# Altium project 105358-3BA002-01_EFM1-hybrid.PrjPCB (part 1 of 2)
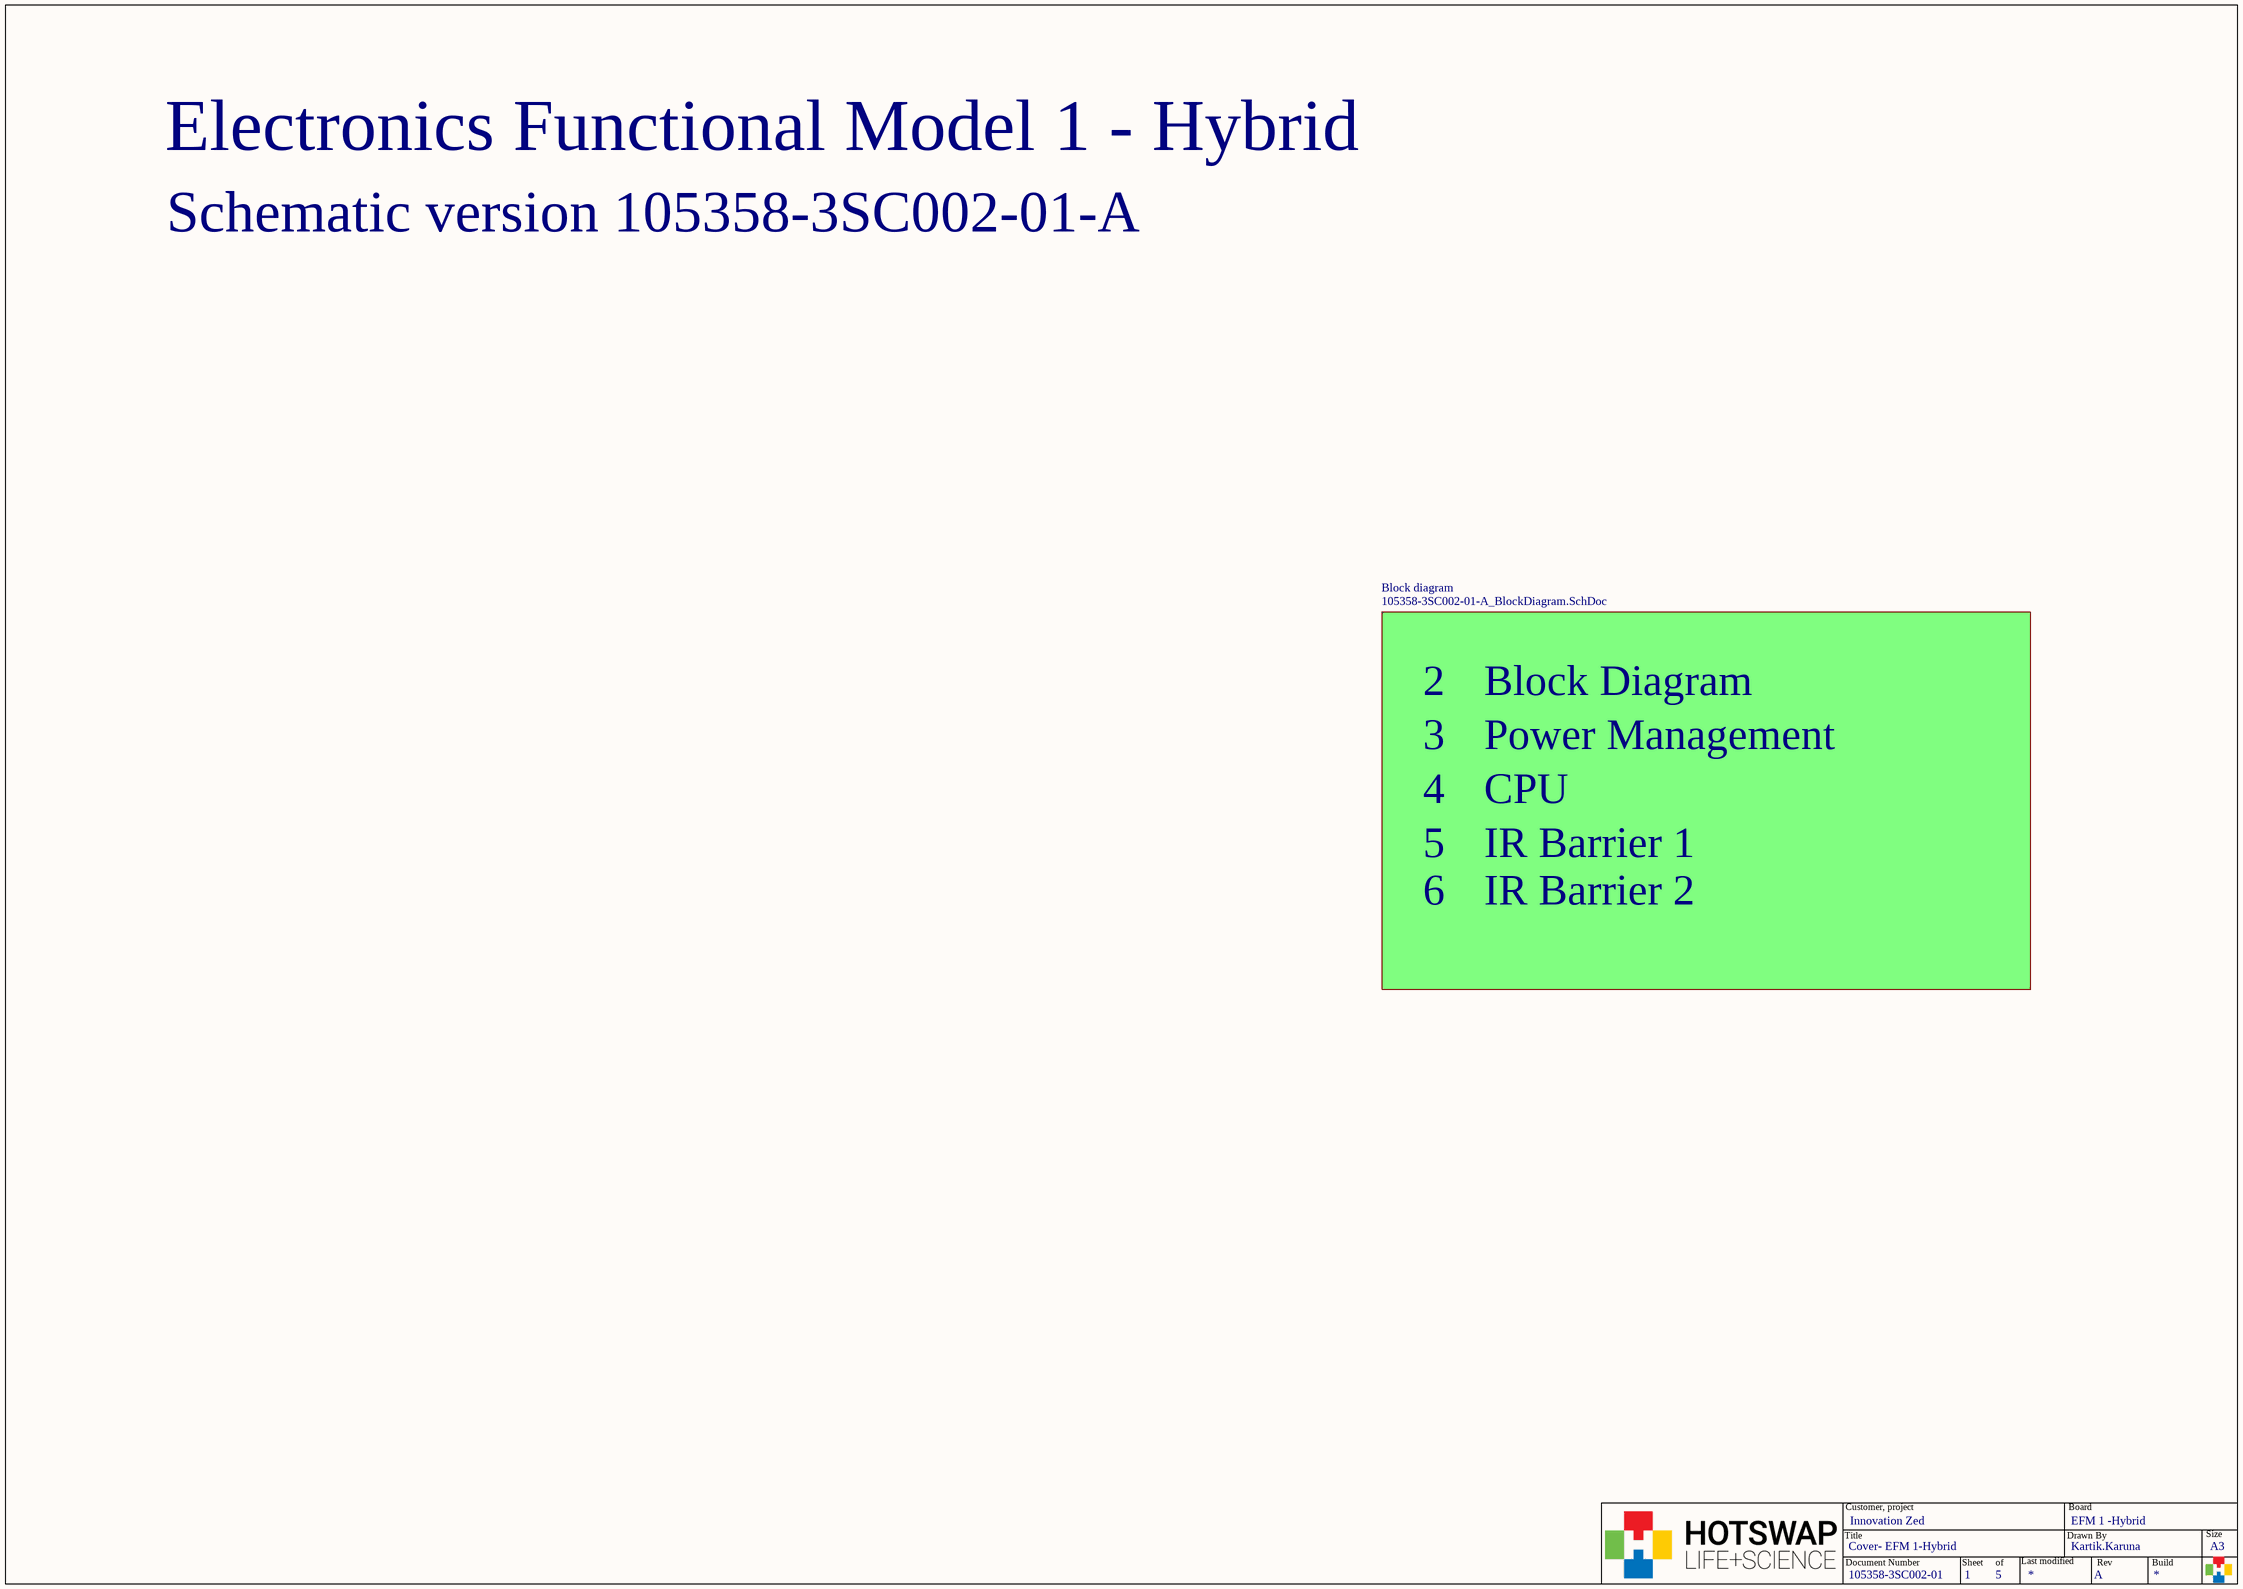
[diagram p0: 105358-3SC002-01-A_Cover.SchDoc]
PrjVersionControl_RevNumber: ' A '; Project_Board: EFM 1 -Hybrid; Project_Customer: Innovation Zed; Project_Document_Number: 105243-3BA001-01-B; Project_Drawn_By: Kartik.Karuna; Project_Revision: A; Project_Total_Sheets: X
6 sheets, 350 parts. Net scope: hierarchical (ports join the sheet entries above them; power ports are global).
Board file: 105358-3LA002-01_EFM1-Hybrid.PcbDoc
Sheets:
  105358-3SC002-01-A_Cover.SchDoc
    Block diagram = 105358-3SC002-01-A_BlockDiagram.SchDoc
      Power Management = 105358-3SC002-01-A_PWR_MGMT.SchDoc
      CPU Board = 105358-3SC002-01-A_CPU.SchDoc
      IO Board = 105358-3SC002-01-A_IR.SchDoc
      IO Board-Extra = 105358-3SC002-01-A_IR_extra.SchDoc

## Sheet 105358-3SC002-01-A_Cover.SchDoc: Cover- EFM 1-Hybrid
size 420 x 297 mm; DrawnBy: KaKa; Organization: Hotswap Norden AB; Address1: Knarrarnäsgatan 7; Address2: SE-164 40 Kista; Address3: Sweden; DocumentNumber: 105358-3SC002-01; SheetNumber: 1; SheetTotal: 5; PageSetup: Record=PageOptions|CenterHorizontal=True|CenterVertical=True|PrintScale=0.98|XCorrection=1.00|YCorrection=1.00|PrintKind=0|BorderSize=5000000|LeftOffset=0|BottomOffset=0|Orientation=2|PaperLength=1000|PaperWidth=1000|Scale=100|PaperSource=7|PrintQuality=-3|MediaType=1|DitherType=10|PrintScaleMode=1|PaperKind=A3|PaperIndex=8

### Sub-sheets
Block diagram = 105358-3SC002-01-A_BlockDiagram.SchDoc: no entries

### Notes on the sheet
- Electronics Functional Model 1 - Hybrid
- Schematic version 105358-3SC002-01-A
- 2
- Block Diagram
- 3
- Power Management
- 4
- 5
- IR Barrier 1
- CPU
- 6
- IR Barrier 2
- Title
- Customer, project
- Drawn By
- Board
- Size
- Document Number
- Sheet
- of
- Last modified
- Rev
- Build
- A3

## Sheet 105358-3SC002-01-A_BlockDiagram.SchDoc: Block Diagram
size 420 x 297 mm; DrawnBy: JeSa , KaKa; Organization: Hotswap Norden AB; Address1: Knarrarnäsgatan 7; Address2: SE-164 40 Kista; Address3: Sweden; DocumentNumber: 105358-3SC001-01; SheetNumber: 2; SheetTotal: 5; PageSetup: Record=PageOptions|CenterHorizontal=True|CenterVertical=True|PrintScale=0.96|XCorrection=1.00|YCorrection=1.00|PrintKind=0|BorderSize=5000000|LeftOffset=0|BottomOffset=0|Orientation=2|PaperLength=1000|PaperWidth=1000|Scale=100|PaperSource=7|PrintQuality=-4|MediaType=1|DitherType=10|PaperKind=A3|PrintScaleMode=1
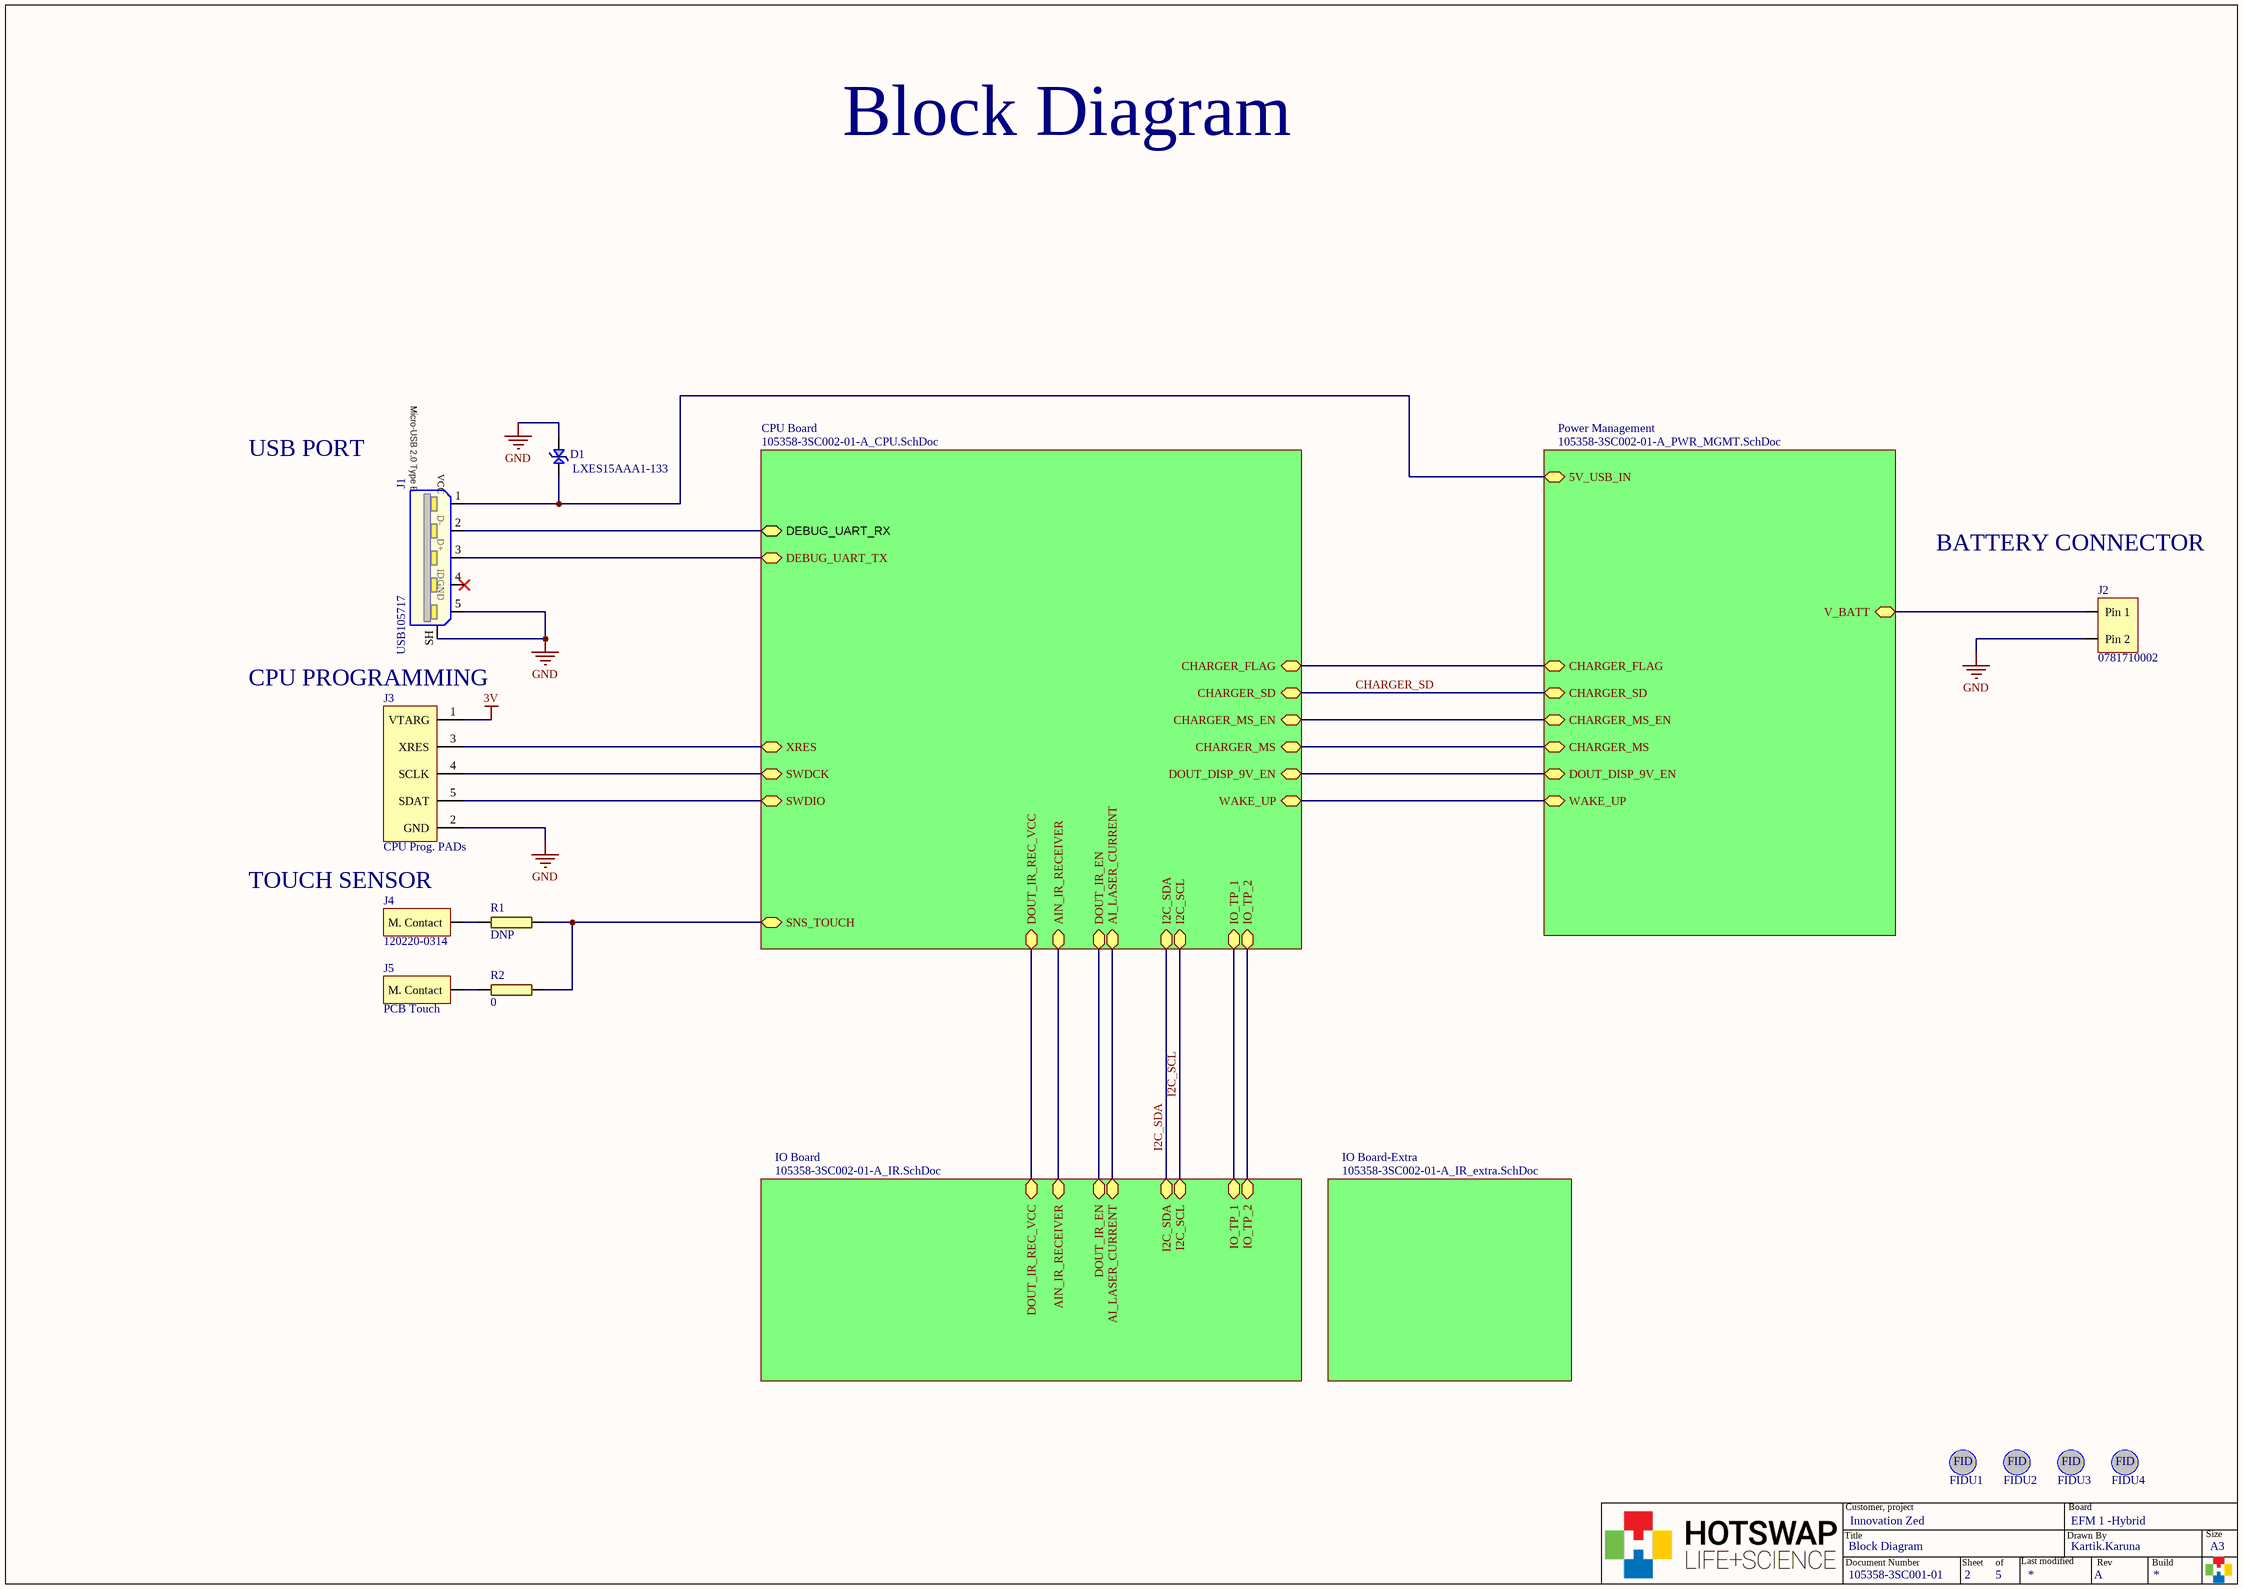
[diagram p1: 105358-3SC002-01-A_BlockDiagram.SchDoc]

### Parts
D1  LXES15AAA1-133  [0402C-GENERIC]
FIDU1  FIDU-miniROUND  [FIDU-MINI-ROUND]  (value not drawn)  (no BOM)
FIDU2  FIDU-miniROUND  [FIDU-MINI-ROUND]  (value not drawn)  (no BOM)
FIDU3  FIDU-miniROUND  [FIDU-MINI-ROUND]  (value not drawn)  (no BOM)
FIDU4  FIDU-miniROUND  [FIDU-MINI-ROUND]  (value not drawn)  (no BOM)
J1  USB105717  [UUSB_MOLEX105017]
J2  0781710002  [PAD 0781710002]
J3  CPU Prog. PADs  [PAD PROGRAMMING]  (no BOM)
J4  120220-0314  [PAD 1.0x1.95mm]
J5  PCB Touch  [Touch_PAD]
R1  DNP  [0402R-GENERIC]
R2  0  [0402R-GENERIC]

### Sub-sheets
CPU Board = 105358-3SC002-01-A_CPU.SchDoc: DEBUG_UART_TX, CHARGER_FLAG, CHARGER_MS, CHARGER_SD, CHARGER_MS_EN, WAKE_UP, DOUT_DISP_9V_EN, XRES, SWDCK, SWDIO, AIN_IR_RECEIVER, I2C_SDA, I2C_SCL, IO_TP_1, IO_TP_2, SNS_TOUCH, AI_LASER_CURRENT, DOUT_IR_REC_VCC, DOUT_IR_EN, DEBUG_UART_RX
IO Board = 105358-3SC002-01-A_IR.SchDoc: AIN_IR_RECEIVER, I2C_SDA, I2C_SCL, IO_TP_1, IO_TP_2, AI_LASER_CURRENT, DOUT_IR_REC_VCC, DOUT_IR_EN
IO Board-Extra = 105358-3SC002-01-A_IR_extra.SchDoc: no entries
Power Management = 105358-3SC002-01-A_PWR_MGMT.SchDoc: CHARGER_FLAG, CHARGER_MS_EN, CHARGER_SD, CHARGER_MS, WAKE_UP, DOUT_DISP_9V_EN, 5V_USB_IN, V_BATT

### Nets
3V: J3.1(VTARG)
GND: D1.1 J1.5(GND) J1.SH(Shell) J2.2(Pin_2) J3.2(GND)
5V_USB_IN: D1.2 J1.1(VCC) ; sheet Power Management/5V_USB_IN
AI_LASER_CURRENT: sheet CPU Board/AI_LASER_CURRENT, sheet IO Board/AI_LASER_CURRENT
AIN_IR_RECEIVER: sheet CPU Board/AIN_IR_RECEIVER, sheet IO Board/AIN_IR_RECEIVER
CHARGER_FLAG: sheet Power Management/CHARGER_FLAG, sheet CPU Board/CHARGER_FLAG
CHARGER_MS: sheet Power Management/CHARGER_MS, sheet CPU Board/CHARGER_MS
CHARGER_MS_EN: sheet Power Management/CHARGER_MS_EN, sheet CPU Board/CHARGER_MS_EN
CHARGER_SD: sheet Power Management/CHARGER_SD, sheet CPU Board/CHARGER_SD
DEBUG_UART_RX: J1.2(D-) ; sheet CPU Board/DEBUG_UART_RX
DEBUG_UART_TX: J1.3(D+) ; sheet CPU Board/DEBUG_UART_TX
DOUT_DISP_9V_EN: sheet Power Management/DOUT_DISP_9V_EN, sheet CPU Board/DOUT_DISP_9V_EN
DOUT_IR_EN: sheet CPU Board/DOUT_IR_EN, sheet IO Board/DOUT_IR_EN
DOUT_IR_REC_VCC: sheet CPU Board/DOUT_IR_REC_VCC, sheet IO Board/DOUT_IR_REC_VCC
I2C_SCL: sheet CPU Board/I2C_SCL, sheet IO Board/I2C_SCL
I2C_SDA: sheet CPU Board/I2C_SDA, sheet IO Board/I2C_SDA
IO_TP_1: sheet CPU Board/IO_TP_1, sheet IO Board/IO_TP_1
IO_TP_2: sheet CPU Board/IO_TP_2, sheet IO Board/IO_TP_2
SNS_TOUCH: R1.2 R2.2 ; sheet CPU Board/SNS_TOUCH
SWDCK: J3.4(SCLK) ; sheet CPU Board/SWDCK
SWDIO: J3.5(SDAT) ; sheet CPU Board/SWDIO
V_BATT: J2.1(Pin_1) ; sheet Power Management/V_BATT
WAKE_UP: sheet Power Management/WAKE_UP, sheet CPU Board/WAKE_UP
XRES: J3.3(XRES) ; sheet CPU Board/XRES
NetJ4_1: J4.1(M._Contact) R1.1
NetJ5_1: J5.1(M._Contact) R2.1

Not connected (* = marked no-connect by the designer): J1 4(ID)*

### Notes on the sheet
- Block Diagram
- USB PORT
- BATTERY CONNECTOR
- CPU PROGRAMMING
- TOUCH SENSOR
- Title
- Customer, project
- Drawn By
- Board
- Size
- Document Number
- Sheet
- of
- Last modified
- Rev
- Build
- A3
- (in symbol FIDU-miniROUND) FID
- (in symbol USB105717) Micro-USB 2.0 Type B

### Library data of the parts
D1 = TVS DIODE 15VWM 0402: Manufacturer: Murata Electronics North America; Type: Zener; Capacitance @ Frequency: 0.05pF @ 1MHz; Voltage - Reverse Standoff (Typ): 15V; Manufacturer Part Number: LXES15AAA1-133; Digi-Key Part Number: 490-13209-1-ND; PackageReference: 0402
J1 = USB105717: CONN RCPT USB-micro; Manufacturer: Molex; Manufacturer Part Number: 105017
J2 = CONNECTOR 1.20MM WTB HEADER VERT 2POS: 1.20MM WTB HEADER VERT 2POS; Manufacturer: Molex, LLC; ComponentLink1URL: http://www.molex.com/pdm_docs/sd/781710002_sd.pdf; ComponentLink1Description: Datasheet; Manufacturer Part Number: 0781710002; Mounting Type: Surface Mount; Digi-Key Part Number: WM4459CT-ND
J3 = PROGRAMMING PADS: CPU Programming PADs
J4 = MICRO UNIVERSAL CONTACT Z 3.5MM: Manufacturer: ITT Cannon, LLC; ComponentLink1URL: https://media.digikey.com/pdf/Data%20Sheets/ITT%20PDFs/120220-0314_Dwg.pdf; ComponentLink1Description: Datasheet; Manufacturer Part Number: 120220-0314; Mounting Type: Surface Mount; Digi-Key Part Number: 1003-2383-1-ND
J5 = PCB Touch: PCB Touch PAD
R1 = 0402R-Do Not Place
R2 = 0402R-0 OHM-0.063W: RES SMD 0.0OHM JUMPER 1/16W 0402; Manufacturer: Yageo; Manufacturer Part Number: RC0402JR-070RL; Resistance (Ohms): 0 Ohm; Power: 0.063W; GENERIC_OK: YES; Digi-Key Part Number: 311-0.0JRCT-ND; PackageReference: 0402; Features: Moisture Resistant
FIDU1-FIDU4 = FIDU-miniROUND: ClassName: FIDU

## Sheet 105358-3SC002-01-A_PWR_MGMT.SchDoc: Power Management
size 420 x 297 mm; DrawnBy: JeSa, KaKa; Organization: Hotswap Norden AB; Address1: Knarrarnäsgatan 7; Address2: SE-164 40 Kista; Address3: Sweden; DocumentNumber: 105358-3SC001-01; SheetNumber: 3; SheetTotal: 5; PageSetup: Record=PageOptions|CenterHorizontal=True|CenterVertical=True|PrintScale=0.96|XCorrection=1.00|YCorrection=1.00|PrintKind=0|BorderSize=5000000|LeftOffset=0|BottomOffset=0|Orientation=2|PaperLength=1000|PaperWidth=1000|Scale=100|PaperSource=7|PrintQuality=-4|MediaType=1|DitherType=10|PaperKind=A3|PrintScaleMode=1
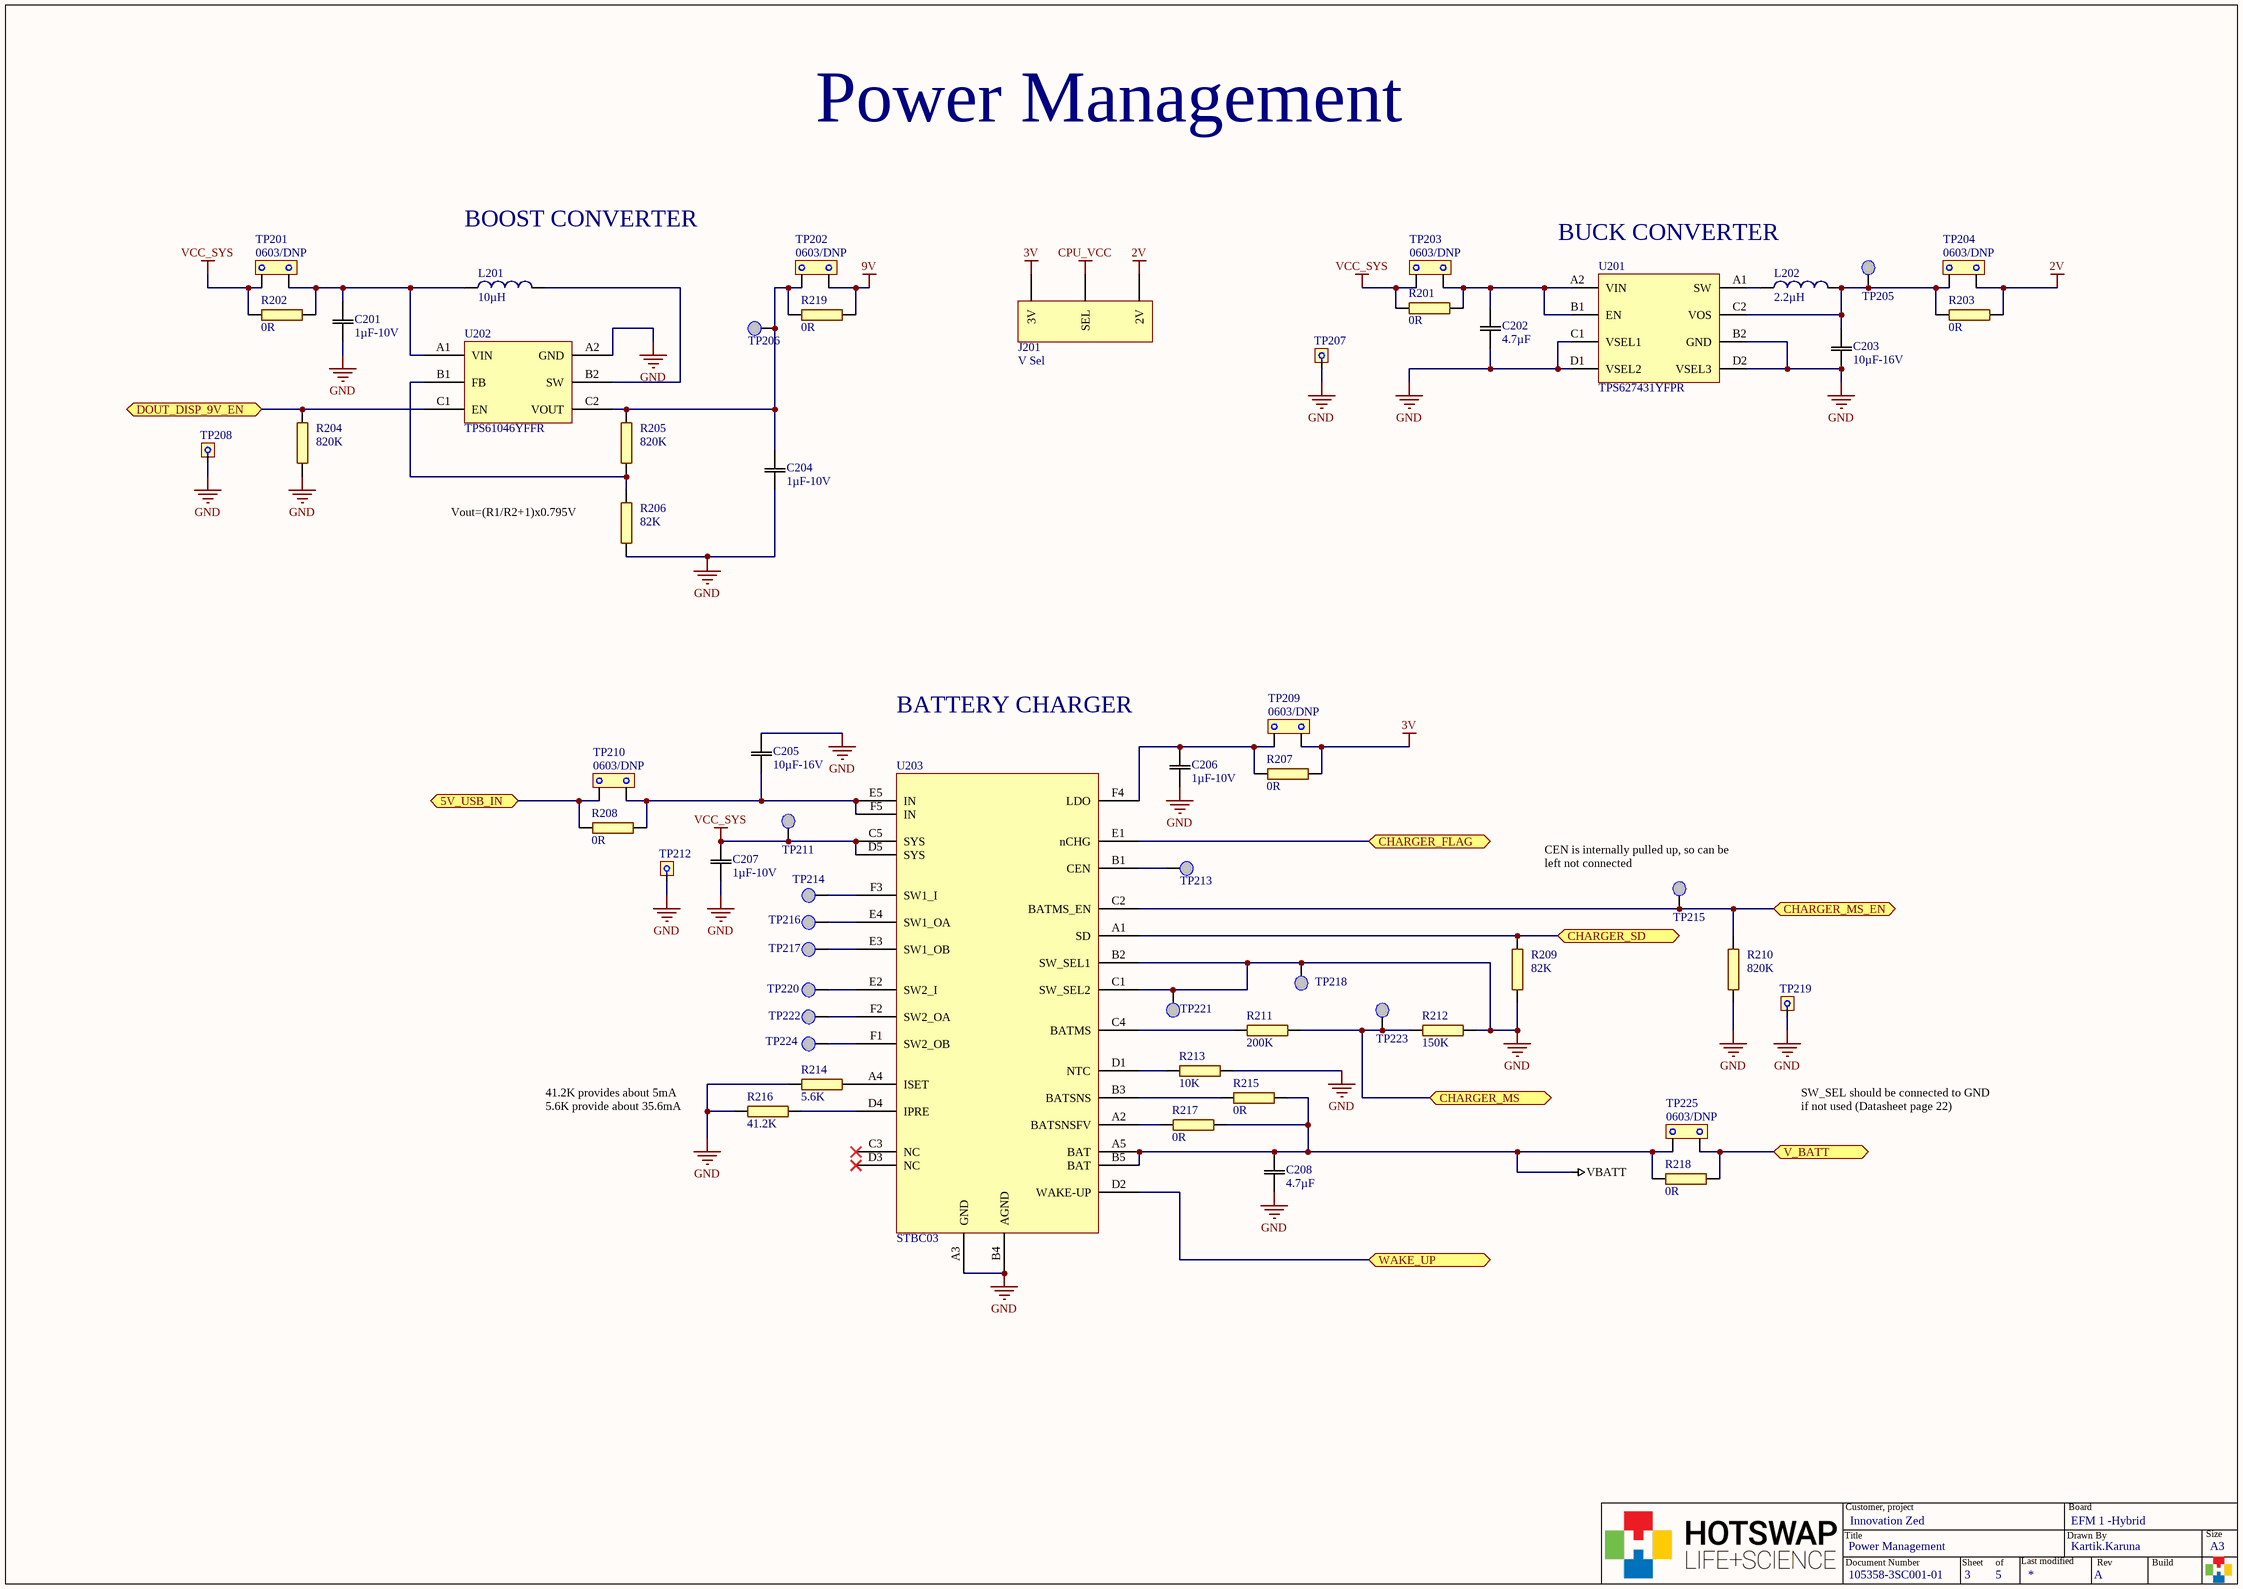
[diagram p2: 105358-3SC002-01-A_PWR_MGMT.SchDoc]

### Parts
C201  1µF-10V  [0402C_HIGH_DENSITY]
C202  4.7µF  [0402C_HIGH_DENSITY]
C203  10µF-16V  [0603C_HIGH_DENSITY]
C204  1µF-10V  [0402C_HIGH_DENSITY]
C205  10µF-16V  [0603C_HIGH_DENSITY]
C206  1µF-10V  [0402C_HIGH_DENSITY]
C207  1µF-10V  [0402C_HIGH_DENSITY]
C208  4.7µF  [0402C_HIGH_DENSITY]
J201  V Sel  [Pin Header 3 x 1 - 2.54mm]
L201  10µH  [0805L_HIGH_DENSITY]
L202  2.2µH  [0805L_HIGH_DENSITY]
R201  0R  [0603R-GENRIC]
R202  0R  [0603R-GENRIC]
R203  0R  [0603R-GENRIC]
R204  820K  [0402R-GENERIC]
R205  820K  [0402R-GENERIC]
R206  82K  [0402R-GENERIC]
R207  0R  [0603R-GENRIC]
R208  0R  [0603R-GENRIC]
R209  82K  [0402R-GENERIC]
R210  820K  [0402R-GENERIC]
R211  200K  [0402R-GENERIC]
R212  150K  [0402R-GENERIC]
R213  10K  [0402R-GENERIC]
R214  5.6K  [0603R-GENRIC]
R215  0R  [0603R-GENRIC]
R216  41.2K  [0603R-GENRIC]
R217  0R  [0603R-GENRIC]
R218  0R  [0603R-GENRIC]
R219  0R  [0603R-GENRIC]
TP201  0603/DNP  [TESTPOINT_C_R0608]  (no BOM)
TP202  0603/DNP  [TESTPOINT_C_R0608]  (no BOM)
TP203  0603/DNP  [TESTPOINT_C_R0608]  (no BOM)
TP204  0603/DNP  [TESTPOINT_C_R0608]  (no BOM)
TP205  TEST POINT  [PAD TEST POINT]  (value not drawn)  (no BOM)
TP206  TEST POINT  [PAD TEST POINT]  (value not drawn)  (no BOM)
TP207  TP_V_HOOK  [Testpoint_Hook]  (value not drawn)  (no BOM)
TP208  TP_V_HOOK  [Testpoint_Hook]  (value not drawn)  (no BOM)
TP209  0603/DNP  [TESTPOINT_C_R0608]  (no BOM)
TP210  0603/DNP  [TESTPOINT_C_R0608]  (no BOM)
TP211  TEST POINT  [PAD TEST POINT]  (value not drawn)  (no BOM)
TP212  TP_V_HOOK  [Testpoint_Hook]  (value not drawn)  (no BOM)
TP213  TEST POINT  [PAD TEST POINT]  (value not drawn)  (no BOM)
TP214  TEST POINT  [PAD TEST POINT]  (value not drawn)  (no BOM)
TP215  TEST POINT  [PAD TEST POINT]  (value not drawn)  (no BOM)
TP216  TEST POINT  [PAD TEST POINT]  (value not drawn)  (no BOM)
TP217  TEST POINT  [PAD TEST POINT]  (value not drawn)  (no BOM)
TP218  TEST POINT  [PAD TEST POINT]  (value not drawn)  (no BOM)
TP219  TP_V_HOOK  [Testpoint_Hook]  (value not drawn)  (no BOM)
TP220  TEST POINT  [PAD TEST POINT]  (value not drawn)  (no BOM)
TP221  TEST POINT  [PAD TEST POINT]  (value not drawn)  (no BOM)
TP222  TEST POINT  [PAD TEST POINT]  (value not drawn)  (no BOM)
TP223  TEST POINT  [PAD TEST POINT]  (value not drawn)  (no BOM)
TP224  TEST POINT  [PAD TEST POINT]  (value not drawn)  (no BOM)
TP225  0603/DNP  [TESTPOINT_C_R0608]  (no BOM)
U201  TPS627431YFPR  [TPS627431YFPR]
U202  TPS61046YFFR  [TPS61046YFFR]
U203  STBC03  [STBC03]

### Ports
5V_USB_IN, CHARGER_FLAG, CHARGER_MS, CHARGER_MS_EN, CHARGER_SD, DOUT_DISP_9V_EN, V_BATT, WAKE_UP

### Nets
2V: J201.3(2V) R203.2 TP204.2
3V: J201.1(3V) R207.2 TP209.2
9V: R219.2 TP202.2
CPU_VCC: J201.2(SEL)
GND: C201.1 C202.1 C203.1 C204.1 C205.2 C206.1 C207.1 C208.1 R204.2 R206.2 R209.2 R210.2 R212.2 R213.2 R214.1 R216.1 TP207.1 TP208.1 TP212.1 TP218.1(Test_Point) TP219.1 TP221.1(Test_Point) U201.B2(GND) U201.C1(VSEL1) U201.D1(VSEL2) U201.D2(VSEL3) U202.A2(GND) U203.A3(GND) U203.B2(SW_SEL1) U203.B4(AGND) U203.C1(SW_SEL2)
VBATT: C208.2 R215.2 R217.2 R218.1 TP225.1 U203.A5(BAT) U203.B5(BAT)
VCC_SYS: C207.2 R201.1 R202.1 TP201.1 TP203.1 TP211.1(Test_Point) U203.C5(SYS) U203.D5(SYS)
5V_USB_IN: R208.1 TP210.1 ; port 5V_USB_IN
CHARGER_FLAG: U203.E1(nCHG) ; port CHARGER_FLAG
CHARGER_MS: R211.2 R212.1 TP223.1(Test_Point) ; port CHARGER_MS
CHARGER_MS_EN: R210.1 TP215.1(Test_Point) U203.C2(BATMS_EN) ; port CHARGER_MS_EN
CHARGER_SD: R209.1 U203.A1(SD) ; port CHARGER_SD
DOUT_DISP_9V_EN: R204.1 U202.C1(EN) ; port DOUT_DISP_9V_EN
V_BATT: R218.2 TP225.2 ; port V_BATT
WAKE_UP: U203.D2(WAKE-UP) ; port WAKE_UP
NetC201_2: C201.2 L201.1 R202.2 TP201.2 U202.A1(VIN)
NetC202_2: C202.2 R201.2 TP203.2 U201.A2(VIN) U201.B1(EN)
NetC203_2: C203.2 L202.2 R203.1 TP204.1 TP205.1(Test_Point) U201.C2(VOS)
NetC204_2: C204.2 R205.1 R219.1 TP202.1 TP206.1(Test_Point) U202.C2(VOUT)
NetC205_1: C205.1 R208.2 TP210.2 U203.E5(IN) U203.F5(IN)
NetC206_2: C206.2 R207.1 TP209.1 U203.F4(LDO)
NetL201_2: L201.2 U202.B2(SW)
NetL202_1: L202.1 U201.A1(SW)
NetR205_2: R205.2 R206.1 U202.B1(FB)
NetR211_1: R211.1 U203.C4(BATMS)
NetR213_1: R213.1 U203.D1(NTC)
NetR214_2: R214.2 U203.A4(ISET)
NetR215_1: R215.1 U203.B3(BATSNS)
NetR216_2: R216.2 U203.D4(IPRE)
NetR217_1: R217.1 U203.A2(BATSNSFV)
NetTP213_1: TP213.1(Test_Point) U203.B1(CEN)
NetTP214_1: TP214.1(Test_Point) U203.F3(SW1_I)
NetTP216_1: TP216.1(Test_Point) U203.E4(SW1_OA)
NetTP217_1: TP217.1(Test_Point) U203.E3(SW1_OB)
NetTP220_1: TP220.1(Test_Point) U203.E2(SW2_I)
NetTP222_1: TP222.1(Test_Point) U203.F2(SW2_OA)
NetTP224_1: TP224.1(Test_Point) U203.F1(SW2_OB)

Not connected (* = marked no-connect by the designer): U203 C3(NC)* D3(NC)*

### Notes on the sheet
- Power Management
- BOOST CONVERTER
- BUCK CONVERTER
- (near R206) Vout=(R1/R2+1)x0.795V
- BATTERY CHARGER
- (near TP215) CEN is internally pulled up, so can be left not connected
- 41.2K provides about 5mA
  5.6K provide about 35.6mA
- SW_SEL should be connected to GND
  if not used (Datasheet page 22)
- Title
- Customer, project
- Drawn By
- Board
- Size
- Document Number
- Sheet
- of
- Last modified
- Rev
- Build
- A3

### Library data of the parts
C201 C204 C206 C207 = 0402C-1uF-10V: 1µF ±10% 10V X5R Ceramic Capacitor 0402; Manufacturer Part Number: CC0402KRX5R6BB105; Manufacturer: Yageo; Capacitance: 1µF; Digi-Key Part Number: 311-1439-1-ND; PackageReference: 0402; Temperature Coefficient: X5R; Tolerance: 10%; Voltage - Rated: 10V
C202 C208 = 0402C-4.7uF-6.3V: 4.7µF ±10% 6.3V X5R Ceramic Capacitor 0402; Manufacturer Part Number: C1005X5R0J475K050BC; Manufacturer: TDK Corporation; Capacitance: 4.7µF; Digi-Key Part Number: 445-5947-1-ND; PackageReference: 0402; Temperature Coefficient: X5R; Tolerance: 10%; Voltage - Rated: 6.3V
C203 C205 = 0603C-10uF-16V: 16µF ±10% 16V X5R Ceramic Capacitor 0603; Manufacturer Part Number: GRT188R61C106KE13D; Manufacturer: Murata Electronics North America; Capacitance: 10µF; Digi-Key Part Number: 490-12317-1-ND; PackageReference: 0603; Temperature Coefficient: X5R; Tolerance: 10%; Voltage - Rated: 16V
J201 = CPU_V_SEL
L201 = 0805L-10uH-0.39Ohm: FIXED IND 10UH 500MA 300 MOHM; Manufacturer: TDK Corporation; Manufacturer Part Number: MLZ2012N100LT000; Number of Lines: 1; Current Rating (Max): 350mA; Tolerance: 20%; DCRDC Resistance (DCR): 390 mOhm Max; Digi-Key Part Number: 445-6762-1-ND; Impedance: 10µH; ComponentLink1Description: Datasheet; ComponentLink1URL: https://product.tdk.com/info/en/catalog/datasheets/inductor_commercial_decoupling_mlz2012_en.pdf; PackageReference: 0805
L202 = 0805L-2.2uH-0.2Ohm: FIXED IND 2.2UH 600MA 0.2OHM SMD; Manufacturer: TDK Corporation; Manufacturer Part Number: MLZ2012M2R2HTD25; Number of Lines: 1; Tolerance: 20%; Digi-Key Part Number: 445-17077-1-ND; Impedance: 2.2µH; Current Rating (Max): 600mA; ComponentLink1Description: Datasheet; ComponentLink1URL: https://www.digikey.com/product-detail/en/tdk-corporation/MLZ2012M2R2HTD25/445-17077-2-ND/4743205; PackageReference: 0805
R201-R203 R207 R208 R215 R217-R219 = 0603R-0R -1%-0.063W: RES SMD 0 OHM 1% 1/10W 0603; Power: 0.063W; GENERIC_OK: YES; Resistance (Ohms): 0R; PackageReference: 0603
R204 R205 R210 = 0402R-820k OHM-1%-0.063W: RES SMD 820kOHM 1% 1/16W 0402; Manufacturer: Yageo; Manufacturer Part Number: RC0402FR-07820KL; Power: 0.063W; GENERIC_OK: YES; Digi-Key Part Number: YAG3240CT-ND; Resistance (Ohms): 820KOhm; Tolerance: 1%; PackageReference: 0402
R206 R209 = 0402R-82k OHM-1%-0.063W: RES SMD 82kOHM 1% 1/16W 0402; Manufacturer: Yageo; Manufacturer Part Number: RC0402FR-0782KL; Power: 0.063W; GENERIC_OK: YES; Digi-Key Part Number: 311-82.0KLRCT-ND; Resistance (Ohms): 82KOhm; Tolerance: 1%; PackageReference: 0402
R211 = 0402R-200k OHM-1%-0.063W: RES SMD 200kOHM 1% 1/16W 0402; Manufacturer: Yageo; Manufacturer Part Number: AC0402FR-07200KL; Power: 0.063W; GENERIC_OK: YES; Digi-Key Part Number: YAG3452CT-ND; Resistance (Ohms): 200KOhm; Tolerance: 1%; PackageReference: 0402; Features: Moisture Resistant
R212 = 0402R-150k OHM-5%-0.063W: RES SMD 150kOHM 5% 1/16W 0402; Manufacturer: Yageo; Manufacturer Part Number: RC0402JR-07150KL; Power: 0.063W; GENERIC_OK: YES; Digi-Key Part Number: 311-150KJRCT-ND; Resistance (Ohms): 150KOhm; Tolerance: 5%; PackageReference: 0402; Features: Moisture Resistant
R213 = 0402R-10k OHM-1%-0.063W: RES SMD 10kOHM 1% 1/16W 0402; Manufacturer: Yageo; Manufacturer Part Number: RC0402FR-0710KL; Power: 0.063W; GENERIC_OK: YES; Digi-Key Part Number: 311-10.0KLRCT-ND; Resistance (Ohms): 10KOhm; Tolerance: 1%; PackageReference: 0402; Features: Moisture Resistant
R214 = 0603R-5.6k OHM-5%-0.063W: RES SMD 5.6kOHM 5% 1/16W 0603; Manufacturer: Yageo; GENERIC_OK: YES; Resistance (Ohms): 5.6KOhm; Tolerance: 5%; PackageReference: 0603
R216 = 0603R-41.2k OHM-1%: RES SMD 41.2kOHM 1% 0603; Manufacturer: Yageo; GENERIC_OK: YES; Resistance (Ohms): 41.2KOhm; Tolerance: 1%; PackageReference: 0402
TP201-TP204 TP209 TP210 TP225 = TP_C_R0603: Test point for Med Current 0402 JUMPER SMD O OHM 1% 1/4W 0603; ClassName: TP
TP205 TP206 TP211 TP213-TP218 TP220-TP224 = TEST POINT: Testing Poiny
TP207 TP208 TP212 TP219 = TP_V_HOOK: Black PC Test Point; Manufacturer: Keystone Electronics; Manufacturer Part Number: 5001; Digi-Key Part Number: 36-5001-ND
U201 = TPS627431YFPR: Buck Converter; Manufacturer: Texas Instruments; Output Configuration: Positive; Function: Step-Down; Voltage - Input (Min): 2.15V; Voltage - Input (Max): 5.5V; Voltage - Output (Min/Fixed): 1.3V; Voltage - Output (Max): 3.1V; Current - Output: 400mA; Frequency - Switching: 1.2MHz; Synchronous Rectifier: Yes; ComponentLink1URL: http://www.ti.com/lit/ds/symlink/tps62743.pdf; ComponentLink1Description: Datasheet; Manufacturer Part Number: TPS627431YFPR; PackageReference: 8-XFBGA, DSBGA; Digi-Key Part Number: 296-44499-2-ND
U202 = TPS61046YFFR: Boost converter 28V; Manufacturer: Texas Instruments; Voltage - Supply (Min): 1.8V; Voltage - Supply (Max): 5.5V; Voltage - Output: 4.5 V ~ 28 V; Current - Output / Channe: 1.2A (Switch); Frequency: 1.05MHz; Supplier 1: Digi-Key; Supplier Part Number 1: 296-44337-1-ND; ComponentLink1URL: http://www.ti.com/lit/ds/symlink/tps61046.pdf; ComponentLink1Description: Datasheet; Manufacturer Part Number: TPS61046YFFR; PackageReference: 6-UFBGA, DSBGA; Digi-Key Part Number: 296-44337-1-ND
U203 = STBC03: Li-Ion linear battery charger; Manufacturer Part Number: STBC03JR; Manufacturer: STMicroelectronics; Battery Chemistry: Lithium-Ion/Polymer; Battery Pack Voltag: 4.2V; Voltage - Supply (Max): 5.4V; Charge Current - Max: 650mA; ComponentLink1URL: http://www.st.com/content/ccc/resource/technical/document/datasheet/group3/05/ea/e8/4e/a7/a6/4a/c6/DM00338132/files/DM00338132.pdf/jcr:content/translations/en.DM00338132.pdf; ComponentLink1Description: Datasheet; PackageReference: 30-UFBGA, FCBGA; Digi-Key Part Number: 497-17241-1-ND

## Sheet 105358-3SC002-01-A_CPU.SchDoc: CPU Board
size 420 x 297 mm; DrawnBy: JeSa , KaKa; Organization: Hotswap Norden AB; Address1: Knarrarnäsgatan 7; Address2: SE-164 40 Kista; Address3: Sweden; DocumentNumber: 105358-3SC001-01; SheetNumber: 4; SheetTotal: 5; PageSetup: Record=PageOptions|CenterHorizontal=True|CenterVertical=True|PrintScale=0.96|XCorrection=1.00|YCorrection=1.00|PrintKind=0|BorderSize=5000000|LeftOffset=0|BottomOffset=0|Orientation=2|PaperLength=1000|PaperWidth=1000|Scale=100|PaperSource=7|PrintQuality=-4|MediaType=1|DitherType=10|PaperKind=A3|PrintScaleMode=1
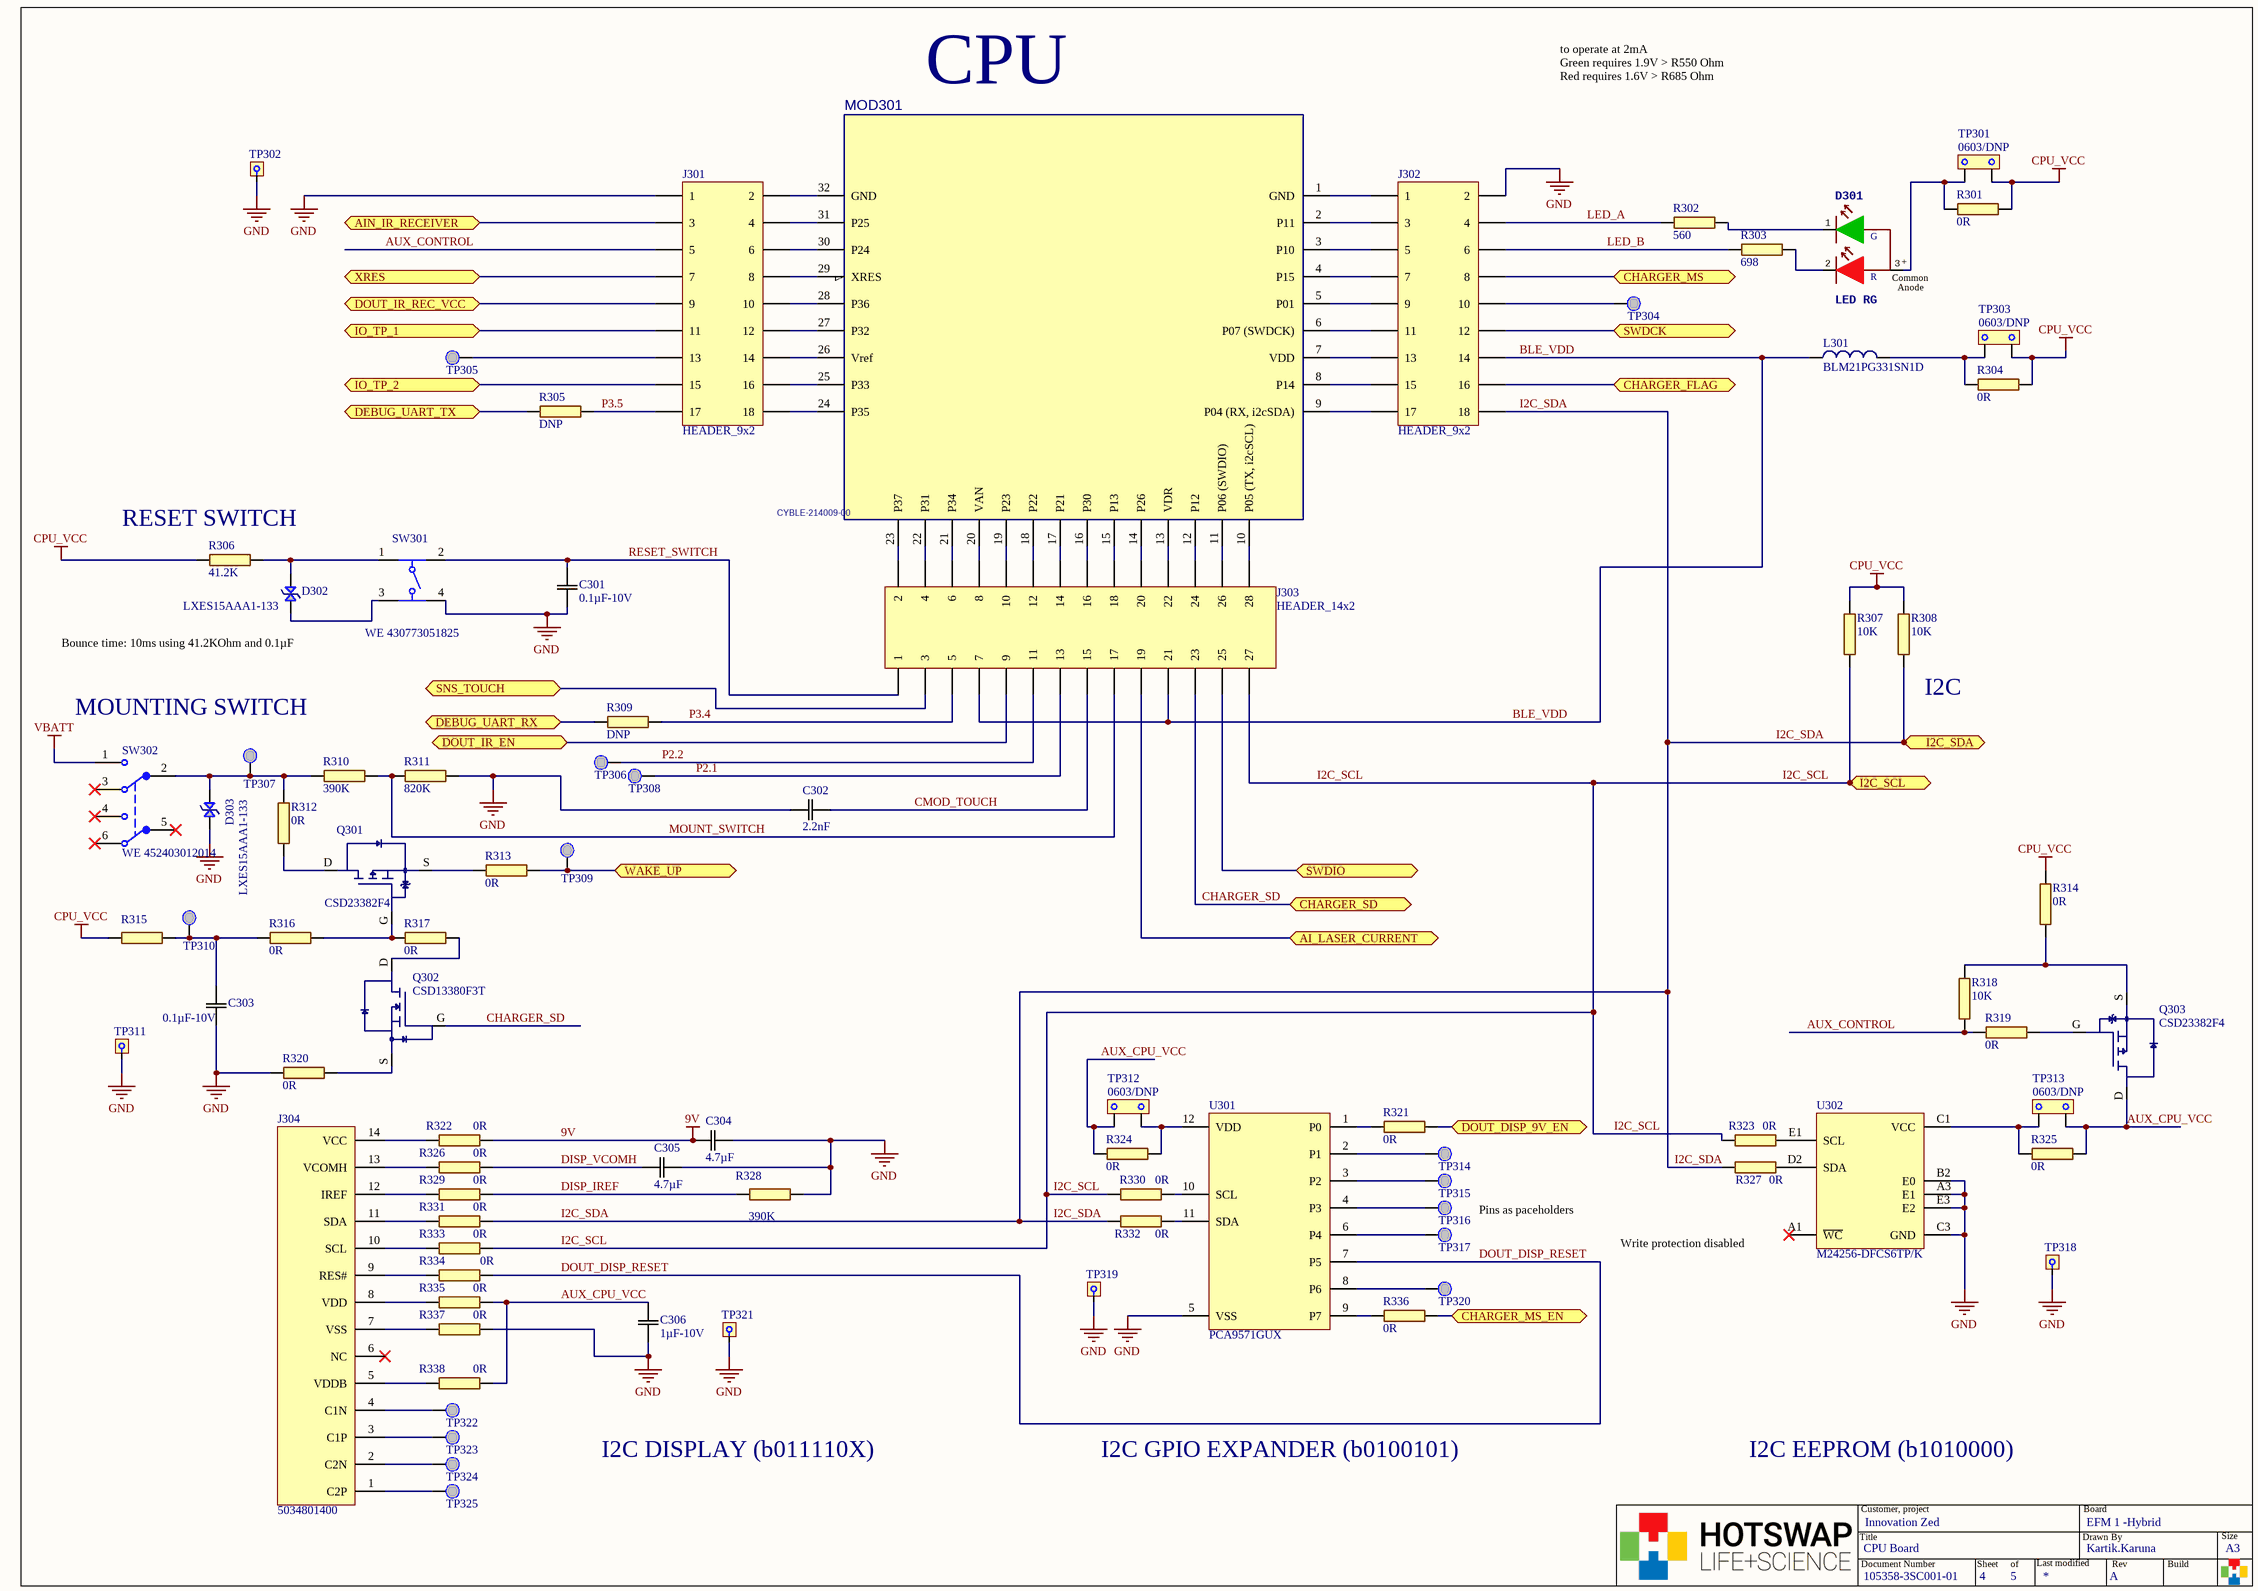
[diagram p3: 105358-3SC002-01-A_CPU.SchDoc]

### Parts
C301  0.1µF-10V  [0402C_HIGH_DENSITY]
C302  2.2nF  [0402C_HIGH_DENSITY]
C303  0.1µF-10V  [0402C_HIGH_DENSITY]
C304  4.7µF  [0402C_HIGH_DENSITY]
C305  4.7µF  [0402C_HIGH_DENSITY]
C306  1µF-10V  [0402C_HIGH_DENSITY]
D301  LED RG  [LED GRN/RED DIFF 1208 R/A SMD]
D302  LXES15AAA1-133  [0402C-GENERIC]
D303  LXES15AAA1-133  [0402C-GENERIC]
J301  HEADER_9x2  [Pin Header 9 x 2 - 2.54mm]
J302  HEADER_9x2  [Pin Header 9 x 2 - 2.54mm]
J303  HEADER_14x2  [Pin Header 14 x 2 - 2.54mm]
J304  5034801400  [5034801400]  (no BOM)
L301  BLM21PG331SN1D  [0805L_HIGH_DENSITY - Hybrid 0402]
MOD301  CYBLE-214009-00  [CYBLE-014008-00_MinKeepOut]
Q301  CSD23382F4  [CSD23382F4 -DFN65P100X35-3L]
Q302  CSD13380F3T  [CSD13380F3-DFN40P69X35-3L]
Q303  CSD23382F4  [CSD23382F4 -DFN65P100X35-3L]
R301  0R  [0603R-GENRIC]
R302  560  [0402R-GENERIC]
R303  698  [0402R-GENERIC]
R304  0R  [0603R-GENRIC]
R305  DNP  [0402R-GENERIC]
R306  41.2K  [0402R-GENERIC]
R307  10K  [0402R-GENERIC]
R308  10K  [0402R-GENERIC]
R309  DNP  [0402R-GENERIC]
R310  390K  [0402R-GENERIC]
R311  820K  [0402R-GENERIC]
R312  0R  [0603R-GENRIC]
R313  0R  [0603R-GENRIC]
R314  0R  [0603R-GENRIC]
R315  (no value)  [0402R-GENERIC]
R316  0R  [0603R-GENRIC]
R317  0R  [0603R-GENRIC]
R318  10K  [0402R-GENERIC]
R319  0R  [0603R-GENRIC]
R320  0R  [0603R-GENRIC]
R321  0R  [0603R-GENRIC]
R322  0R  [0603R-GENRIC]
R323  0R  [0603R-GENRIC]
R324  0R  [0603R-GENRIC]
R325  0R  [0603R-GENRIC]
R326  0R  [0603R-GENRIC]
R327  0R  [0603R-GENRIC]
R328  390K  [0402R-GENERIC]
R329  0R  [0603R-GENRIC]
R330  0R  [0603R-GENRIC]
R331  0R  [0603R-GENRIC]
R332  0R  [0603R-GENRIC]
R333  0R  [0603R-GENRIC]
R334  0R  [0603R-GENRIC]
R335  0R  [0603R-GENRIC]
R336  0R  [0603R-GENRIC]
R337  0R  [0603R-GENRIC]
R338  0R  [0603R-GENRIC]
SW301  WE 430773051825  [4307x30518xx_6x6x5.1]
SW302  WE 452403012014  [WE452403012014]
TP301  0603/DNP  [TESTPOINT_C_R0608]  (no BOM)
TP302  TP_V_HOOK  [Testpoint_Hook]  (value not drawn)  (no BOM)
TP303  0603/DNP  [TESTPOINT_C_R0608]  (no BOM)
TP304  TEST POINT  [PAD TEST POINT]  (value not drawn)  (no BOM)
TP305  TEST POINT  [PAD TEST POINT]  (value not drawn)  (no BOM)
TP306  TEST POINT  [PAD TEST POINT]  (value not drawn)  (no BOM)
TP307  TEST POINT  [PAD TEST POINT]  (value not drawn)  (no BOM)
TP308  TEST POINT  [PAD TEST POINT]  (value not drawn)  (no BOM)
TP309  TEST POINT  [PAD TEST POINT]  (value not drawn)  (no BOM)
TP310  TEST POINT  [PAD TEST POINT]  (value not drawn)  (no BOM)
TP311  TP_V_HOOK  [Testpoint_Hook]  (value not drawn)  (no BOM)
TP312  0603/DNP  [TESTPOINT_C_R0608]  (no BOM)
TP313  0603/DNP  [TESTPOINT_C_R0608]  (no BOM)
TP314  TEST POINT  [PAD TEST POINT]  (value not drawn)  (no BOM)
TP315  TEST POINT  [PAD TEST POINT]  (value not drawn)  (no BOM)
TP316  TEST POINT  [PAD TEST POINT]  (value not drawn)  (no BOM)
TP317  TEST POINT  [PAD TEST POINT]  (value not drawn)  (no BOM)
TP318  TP_V_HOOK  [Testpoint_Hook]  (value not drawn)  (no BOM)
TP319  TP_V_HOOK  [Testpoint_Hook]  (value not drawn)  (no BOM)
TP320  TEST POINT  [PAD TEST POINT]  (value not drawn)  (no BOM)
TP321  TP_V_HOOK  [Testpoint_Hook]  (value not drawn)  (no BOM)
TP322  TEST POINT  [PAD TEST POINT]  (value not drawn)  (no BOM)
TP323  TEST POINT  [PAD TEST POINT]  (value not drawn)  (no BOM)
TP324  TEST POINT  [PAD TEST POINT]  (value not drawn)  (no BOM)
TP325  TEST POINT  [PAD TEST POINT]  (value not drawn)  (no BOM)
U301  PCA9571GUX  [PCA9571-XQFN12]
U302  M24256-DFCS6TP/K  [BGAS8_M24256-DFCS6_1]

### Ports
AI_LASER_CURRENT, AIN_IR_RECEIVER, CHARGER_FLAG, CHARGER_MS, CHARGER_MS_EN, CHARGER_SD, DEBUG_UART_RX, DEBUG_UART_TX, DOUT_DISP_9V_EN, DOUT_IR_EN, DOUT_IR_REC_VCC, I2C_SCL, I2C_SDA, IO_TP_1, IO_TP_2, SNS_TOUCH, SWDCK, SWDIO, WAKE_UP, XRES

### Nets
9V: C304.1 R322.2
CPU_VCC: R301.2 R304.2 R306.1 R307.1 R308.1 R314.2 R315.1 TP301.2 TP303.2
GND: C301.1 C302.2 C303.1 C304.2 C305.1 C306.1 D303.1 J301.1 J302.2 R311.1 R320.2 R328.2 R337.2 SW301.4 TP302.1 TP311.1 TP318.1 TP319.1 TP321.1 U301.5(VSS) U302.A3(E1) U302.B2(E0) U302.C3(GND) U302.E3(E2)
VBATT: SW302.1
AI_LASER_CURRENT: J303.19 ; port AI_LASER_CURRENT
AIN_IR_RECEIVER: J301.3 ; port AIN_IR_RECEIVER
AUX_CONTROL: J301.5 R318.2 R319.1
AUX_CPU_VCC: C306.2 Q303.D R324.1 R325.2 R335.2 R338.2 TP312.1 TP313.2
BLE_VDD: J302.14 J303.7 J303.21 L301.1
CHARGER_FLAG: J302.16 ; port CHARGER_FLAG
CHARGER_MS: J302.8 ; port CHARGER_MS
CHARGER_MS_EN: R336.2 ; port CHARGER_MS_EN
CHARGER_SD: J303.23 Q302.G ; port CHARGER_SD
CMOD_TOUCH: C302.1 J303.15
DEBUG_UART_RX: R309.1 ; port DEBUG_UART_RX
DEBUG_UART_TX: R305.1 ; port DEBUG_UART_TX
DISP_IREF: R328.1 R329.2
DISP_VCOMH: C305.2 R326.2
DOUT_DISP_9V_EN: R321.2 ; port DOUT_DISP_9V_EN
DOUT_DISP_RESET: R334.2 U301.7(P5)
DOUT_IR_EN: J303.9 ; port DOUT_IR_EN
DOUT_IR_REC_VCC: J301.9 ; port DOUT_IR_REC_VCC
I2C_SCL: J303.27 R307.2 R323.1 R330.1 R333.2 ; port I2C_SCL
I2C_SDA: J302.18 R308.2 R327.1 R331.2 R332.1 ; port I2C_SDA
IO_TP_1: J301.11 ; port IO_TP_1
IO_TP_2: J301.15 ; port IO_TP_2
LED_A: J302.4 R302.1
LED_B: J302.6 R303.1
MOUNT_SWITCH: J303.17 R310.2 R311.2
P2.1: J303.13 TP308.1(Test_Point)
P2.2: J303.11 TP306.1(Test_Point)
P3.4: J303.5 R309.2
P3.5: J301.17 R305.2
RESET_SWITCH: C301.2 J303.1 SW301.2
SNS_TOUCH: J303.3 ; port SNS_TOUCH
SWDCK: J302.12 ; port SWDCK
SWDIO: J303.25 ; port SWDIO
WAKE_UP: R313.2 TP309.1(Test_Point) ; port WAKE_UP
XRES: J301.7 ; port XRES
NetC303_2: C303.2 R315.2 R316.2 TP310.1(Test_Point)
NetD301_1: D301.1(R) R302.2
NetD301_2: D301.2(G) R303.2
NetD301_3: D301.3 R301.1 TP301.1
NetD302_1: D302.1 SW301.3
NetD302_2: D302.2 R306.2 SW301.1
NetD303_2: D303.2 R310.1 R312.1 SW302.2(COM) TP307.1(Test_Point)
NetJ301_2: J301.2 MOD301.32(GND)
NetJ301_4: J301.4 MOD301.31(P25)
NetJ301_6: J301.6 MOD301.30(P24)
NetJ301_8: J301.8 MOD301.29(XRES)
NetJ301_10: J301.10 MOD301.28(P36)
NetJ301_12: J301.12 MOD301.27(P32)
NetJ301_13: J301.13 TP305.1(Test_Point)
NetJ301_14: J301.14 MOD301.26(Vref)
NetJ301_16: J301.16 MOD301.25(P33)
NetJ301_18: J301.18 MOD301.24(P35)
NetJ302_1: J302.1 MOD301.1(GND)
NetJ302_3: J302.3 MOD301.2(P11)
NetJ302_5: J302.5 MOD301.3(P10)
NetJ302_7: J302.7 MOD301.4(P15)
NetJ302_9: J302.9 MOD301.5(P01)
NetJ302_10: J302.10 TP304.1(Test_Point)
NetJ302_11: J302.11 MOD301.6(P07_(SWDCK))
NetJ302_13: J302.13 MOD301.7(VDD)
NetJ302_15: J302.15 MOD301.8(P14)
NetJ302_17: J302.17 MOD301.9(P04_(RX,_i2cSDA))
NetJ303_2: J303.2 MOD301.23(P37)
NetJ303_4: J303.4 MOD301.22(P31)
NetJ303_6: J303.6 MOD301.21(P34)
NetJ303_8: J303.8 MOD301.20(VAN)
NetJ303_10: J303.10 MOD301.19(P23)
NetJ303_12: J303.12 MOD301.18(P22)
NetJ303_14: J303.14 MOD301.17(P21)
NetJ303_16: J303.16 MOD301.16(P30)
NetJ303_18: J303.18 MOD301.15(P13)
NetJ303_20: J303.20 MOD301.14(P26)
NetJ303_22: J303.22 MOD301.13(VDR)
NetJ303_24: J303.24 MOD301.12(P12)
NetJ303_26: J303.26 MOD301.11(P06_(SWDIO))
NetJ303_28: J303.28 MOD301.10(P05_(TX,_i2cSCL))
NetJ304_1: J304.1(C2P) TP325.1(Test_Point)
NetJ304_2: J304.2(C2N) TP324.1(Test_Point)
NetJ304_3: J304.3(C1P) TP323.1(Test_Point)
NetJ304_4: J304.4(C1N) TP322.1(Test_Point)
NetJ304_5: J304.5(VDDB) R338.1
NetJ304_7: J304.7(VSS) R337.1
NetJ304_8: J304.8(VDD) R335.1
NetJ304_9: J304.9(RES#) R334.1
NetJ304_10: J304.10(SCL) R333.1
NetJ304_11: J304.11(SDA) R331.1
NetJ304_12: J304.12(IREF) R329.1
NetJ304_13: J304.13(VCOMH) R326.1
NetJ304_14: J304.14(VCC) R322.1
NetL301_2: L301.2 R304.1 TP303.1
NetQ301_D: Q301.D R312.2
NetQ301_G: Q301.G R316.1 R317.2
NetQ301_S: Q301.S R313.1
NetQ302_D: Q302.D R317.1
NetQ302_S: Q302.S R320.1
NetQ303_G: Q303.G R319.2
NetQ303_S: Q303.S R314.1 R318.1
NetR321_1: R321.1 U301.1(P0)
NetR323_2: R323.2 U302.E1(SCL)
NetR324_2: R324.2 TP312.2 U301.12(VDD)
NetR325_1: R325.1 TP313.1 U302.C1(VCC)
NetR327_2: R327.2 U302.D2(SDA)
NetR330_2: R330.2 U301.10(SCL)
NetR332_2: R332.2 U301.11(SDA)
NetR336_1: R336.1 U301.9(P7)
NetTP314_1: TP314.1(Test_Point) U301.2(P1)
NetTP315_1: TP315.1(Test_Point) U301.3(P2)
NetTP316_1: TP316.1(Test_Point) U301.4(P3)
NetTP317_1: TP317.1(Test_Point) U301.6(P4)
NetTP320_1: TP320.1(Test_Point) U301.8(P6)

Not connected (* = marked no-connect by the designer): J304 6(NC)*; SW302 3* 4* 5(COM)* 6*; U302 A1(~{WC})*

### Notes on the sheet
- CPU
- to operate at 2mA
  Green requires 1.9V > R550 Ohm
  Red requires 1.6V > R685 Ohm
- (near R306) RESET SWITCH
- (near D302) Bounce time: 10ms using 41.2KOhm and 0.1µF
- MOUNTING SWITCH
- (near R308) I2C
- Pins as paceholders
- Write protection disabled
- I2C DISPLAY (b011110X)
- I2C GPIO EXPANDER (b0100101)
- I2C EEPROM (b1010000)
- Title
- Customer, project
- Drawn By
- Board
- Size
- Document Number
- Sheet
- of
- Last modified
- Rev
- Build
- A3
- (in symbol LED GRN/RED DIFF 1208 R/A SMD) +; Common; Anode

### Library data of the parts
C301 C303 = 0402C-0.1uF-10V: 0.1µF ±10% 10V X5R Ceramic Capacitor 0402; Manufacturer Part Number: CC0402KRX5R6BB104; Manufacturer: Yageo; Capacitance: 0.1µF; Digi-Key Part Number: 311-1336-1-ND; PackageReference: 0402; Temperature Coefficient: X5R; Tolerance: 10%; Voltage - Rated: 10V
C302 = 0402C-2.2nF-50V: 2.2nF ±10% 50V X5R Ceramic Capacitor 0402; Manufacturer Part Number: GRM155R61H222KA01D; Manufacturer: Murata Electronics North America; Capacitance: 2.2nF; Digi-Key Part Number: 490-8257-1-ND; PackageReference: 0402; Temperature Coefficient: X5R; Tolerance: 10%; Voltage - Rated: 50V
C304 C305 = 0402C-4.7uF-6.3V: as C202 on sheet 105358-3SC002-01-A_PWR_MGMT; Capacitance: 4.7µF; Digi-Key Part Number: 445-5947-1-ND; PackageReference: 0402; Temperature Coefficient: X5R; Tolerance: 10%; Voltage - Rated: 6.3V
C306 = 0402C-1uF-10V: as C201 on sheet 105358-3SC002-01-A_PWR_MGMT; Capacitance: 1µF; Digi-Key Part Number: 311-1439-1-ND; PackageReference: 0402; Temperature Coefficient: X5R; Tolerance: 10%; Voltage - Rated: 10V
D301 = LED GRN/RED DIFF 1208 R/A SMD: Manufacturer: Stanley Electric Co; Manufacturer Part Number: BRPY1211F-TR; Color: Red, Green; Voltage - Forward (Vf) (Typ): 2.1V Green, 1.7V Red; Current - Test: 20mA Green, 20mA Red; Wavelength - Peak: 570nm Green, 660nm Red; Millicandela Rating: 8.8mcd Green, 17.6mcd Red; ComponentLink1Description: Datasheet; ComponentLink1URL: https://media.digikey.com/pdf/Data%20Sheets/Stanley%20Electric%20PDFs/1211F_Series.pdf; Digi-Key Part Number: 404-1089-1-ND
D302 D303 = TVS DIODE 15VWM 0402: as D1 on sheet 105358-3SC002-01-A_BlockDiagram; Manufacturer Part Number: LXES15AAA1-133; Digi-Key Part Number: 490-13209-1-ND; PackageReference: 0402
J301 J302 = HEADER_9x2: 18 Positions Header Connector 0.100" (2.54mm) Through Hole Gold or Gold; Manufacturer Part Number: 77313-818-18LF; Manufacturer: Amphenol FCI; ComponentLink1URL: http://portal.fciconnect.com/Comergent//fci/drawing/77313.pdf; ComponentLink1Description: Datasheet; Mounting Type: Through Hole; Through Hole: 0.100" (2.54mm); Digi-Key Part Number: 609-5140-ND
J303 = HEADER_14x2: CONN HEADER VERT DUAL 28POS 2.54; Manufacturer Part Number: 61302821121; Manufacturer: Wurth Electronics Inc.; Through Hole: 0.100" (2.54mm); ComponentLink1URL: http://katalog.we-online.de/em/datasheet/6130xx21121.pdf; ComponentLink1Description: Datasheet; Mounting Type: Through Hole; Digi-Key Part Number: 732-5305-ND
J304 = Molex-5034801400: Connector molex to OLED Display; Manufacturer: Molex, LLC; Number of Positions: 14; Pitch: 0.020" (0.50mm); Flat Flex Type: FFC, FPC; FFC, FCB Thickness: 0.30mm; Mating Cycles: 10; Manufacturer Part Number: 5034801400; Digi-Key Part Number: WM1442CT-ND; ComponentLink1Description: Datasheet; ComponentLink1URL: http://www.molex.com/pdm_docs/sd/5034801400_sd.pdf; Contact Finish: Gold
L301 = BLM21PG331SN1D: 0805 Ferrite Bead 330Ohm@100MHz; Manufacturer: Murata Electronics North America; Number of Lines: 1; Current Rating (Max): 1.5A; Filter Type: Power Line; DC Resistance (DCR) (Max): 70 mOhm; Digi-Key Part Number: 490-5988-1-ND; Manufacturer Part Number: BLM21PG331SN1D; ComponentLink1Description: Datasheet; ComponentLink1URL: http://www.murata.com/en-global/products/productdata/8796733767710/S0580E.pdf; PackageReference: 0805 (2012 Metric); Impedance @ FRequency: 330 Ohm @ 100MHz
MOD301 = CYBLE-214009-00: BLE PSoC Module 4.1; Manufacturer: Cypress Semiconductor Corp; Protocol: Bluetooth v4.1; Frequency: 2.4GHz; Data Rate: 1Mbps; Power - Output: 3dBm; Sensitivity: -91dBm; Voltage - Supply: 1.7 V ~ 5.5 V; Current - Receiving: 16.4mA; Current - Transmitting: 15.6mA; Supplier 1: Digi-Key; Supplier Part Number 1: 428-3809-ND; ComponentLink1URL: http://www.cypress.com/file/223701/download; ComponentLink1Description: Datasheet; Manufacturer Part Number: CYBLE-214009-00; Digi-Key Part Number: 428-3809-ND
Q301 Q303 = CSD23382F4: MOSFET P-CH 12V 22A 3PICOSTAR; Manufacturer: Texas Instruments; FET Type: P-Channel; Digi-Key Part Number: 296-40003-1-ND; Manufacturer Part Number: CSD23382F4; Package / Case: 3-XFDFN; ComponentLink1Description: Datasheet; ComponentLink1URL: http://www.ti.com/lit/ds/symlink/csd23382f4.pdf
Q302 = CSD13380F3T: 12V N-CHANNEL FEMTOFET MOSFET; Manufacturer: Texas Instruments; Digi-Key Part Number: CSD13380F3T; Manufacturer Part Number: CSD13380F3T; FET Type: N-Channel; Package / Case: 3-XFDFN; ComponentLink1Description: Datasheet; ComponentLink1URL: http://www.ti.com/lit/ds/symlink/csd13380f3.pdf
R301 R304 R312-R314 R316 R317 R319-R327 R329-R338 = 0603R-0R -1%-0.063W: as R201 on sheet 105358-3SC002-01-A_PWR_MGMT; Resistance (Ohms): 0R; PackageReference: 0603
R302 = 0402R-560 OHM-1%-0.063W: RES SMD 560OHM 1% 1/16W 0402; Manufacturer: Samsung Electro-Mechanics America, Inc.; Manufacturer Part Number: RC1005F561CS; Power: 0.063W; GENERIC_OK: YES; Digi-Key Part Number: 1276-3473-1-ND; Resistance (Ohms): 560Ohm; Tolerance: 1%; PackageReference: 0402; Features: Moisture Resistant
R303 = 0402R-698 OHM-1%-0.063W: RES SMD 698 OHM 1% 1/16W 0402; Manufacturer: Yageo; Manufacturer Part Number: RC0402FR-07698RL; Resistance (Ohms): 698Ohm; Power: 0.063W; GENERIC_OK: YES; Digi-Key Part Number: YAG3215CT-ND; Tolerance: 1%; PackageReference: 0402; Features: Moisture Resistant
R305 R309 = 0402R-Do Not Place
R306 = 0402R-41.2k OHM-1%-0.063W: RES SMD 41.2kOHM 1% 1/16W 0402; Manufacturer: Yageo; Manufacturer Part Number: RC0402FR-0741K2L; Power: 0.063W; GENERIC_OK: YES; Digi-Key Part Number: YAG3155CT-ND; Resistance (Ohms): 41.2KOhm; Tolerance: 1%; PackageReference: 0402
R307 R308 R318 = 0402R-10k OHM-1%-0.063W: as R213 on sheet 105358-3SC002-01-A_PWR_MGMT; Digi-Key Part Number: 311-10.0KLRCT-ND; Resistance (Ohms): 10KOhm; Tolerance: 1%; PackageReference: 0402; Features: Moisture Resistant
R310 R315 R328 = 0402R-390k OHM-1%-0.063W: RES SMD 390kOHM 1% 1/16W 0402; Manufacturer: Yageo; Manufacturer Part Number: RC0402FR-07390KL; Power: 0.063W; GENERIC_OK: YES; Digi-Key Part Number: YAG3143CT-ND; Resistance (Ohms): 390KOhm; Tolerance: 1%; PackageReference: 0402; Features: Moisture Resistant
R311 = 0402R-820k OHM-1%-0.063W: as R204 on sheet 105358-3SC002-01-A_PWR_MGMT; Digi-Key Part Number: YAG3240CT-ND; Resistance (Ohms): 820KOhm; Tolerance: 1%; PackageReference: 0402
SW301 = WE_430773051825: WS-TASV 6x6mm J-Hook Hermetic Tact Switch, SMD version; Manufacturer: Wurth Elektronik; Operation Force: 250g; ComponentLink1URL: http://www.we-online.de; ComponentLink1Description: Manufacturer; Manufacturer Part Number: 430773051825; ComponentLink2Description: Datasheet; ComponentLink2URL: http://katalog.we-online.de/em/datasheet/430773051825.pdf; Published Date: June 2017; Life Cycle: 500000 cycles; Size: 6x6x5.1 mm
SW302 = SWITCH-TOGGLE_452403012014: WS-SLSV 7.65x5.5 mm SMD Vertical; ComponentLink1URL: http://www.we-online.de; ComponentLink1Description: Manufacturer; ComponentLink2Description: Datasheet; ComponentLink2URL: http://katalog.we-online.de/em/datasheet/452403012014.pdf; Published Date: June 2017; Part Number: 452403012014; Publisher: Wurth Elektronik
TP301 TP303 TP312 TP313 = TP_C_R0603: as TP201 on sheet 105358-3SC002-01-A_PWR_MGMT; ClassName: TP
TP302 TP311 TP318 TP319 TP321 = TP_V_HOOK: as TP207 on sheet 105358-3SC002-01-A_PWR_MGMT; Digi-Key Part Number: 36-5001-ND
TP304-TP310 TP314-TP317 TP320 TP322-TP325 = TEST POINT: Testing Poiny
U301 = PCA9571GUX: IC I/O EXPANDER I2C 12XQFN; Manufacturer: NXP USA Inc.; Voltage - Supply: 1.1 V ~ 3.6 V; Clock Frequency: 1MHz; Interface: I²C; Output Type: Push-Pull; ComponentLink1URL: http://www.nxp.com/docs/en/data-sheet/PCA9571.pdf; ComponentLink1Description: Datasheet; Manufacturer Part Number: PCA9571GUX; PackageReference: 12-XFQFN; Digi-Key Part Number: 568-12400-1-ND
U302 = M24256-DFCS6TPK: IC EEPROM 256KBIT 1MHZ 8WLCSP; Manufacturer: STMicroelectronics; Memory Interface: I²C; Voltage - Supply: 1.7 V ~ 5.5 V; Memory Type: Non-Volatile; Write Cycle Time - Word, Page: 5ms; ComponentLink1URL: http://www.st.com/content/ccc/resource/technical/document/datasheet/b6/38/3e/3f/fe/a6/48/c2/CD00001891.pdf/files/CD00001891.pdf/jcr:content/translations/en.CD00001891.pdf; ComponentLink1Description: Dataseet; Manufacturer Part Number: M24256-DFCS6TP/K; PackageReference: 8-WFBGA; Memory Forma: EEPROM; Clock Frequency: 1MHz; Digi-Key Part Number: 497-13611-1-ND